# Altium schematic sheet STLink.SchDoc
size A; PageSetup: Record=PageOptions|CenterHorizontal=True|CenterVertical=True|PrintScale=1.07|XCorrection=1.00|YCorrection=1.00|PrintKind=1|BorderSize=5000000|LeftOffset=0|BottomOffset=0|Orientation=2|PaperLength=1000|PaperWidth=1000|Scale=100|PaperSource=257|PrintQuality=600|MediaType=1|DitherType=10|PrintScaleMode=1|PaperKind=Letter|PaperIndex=1
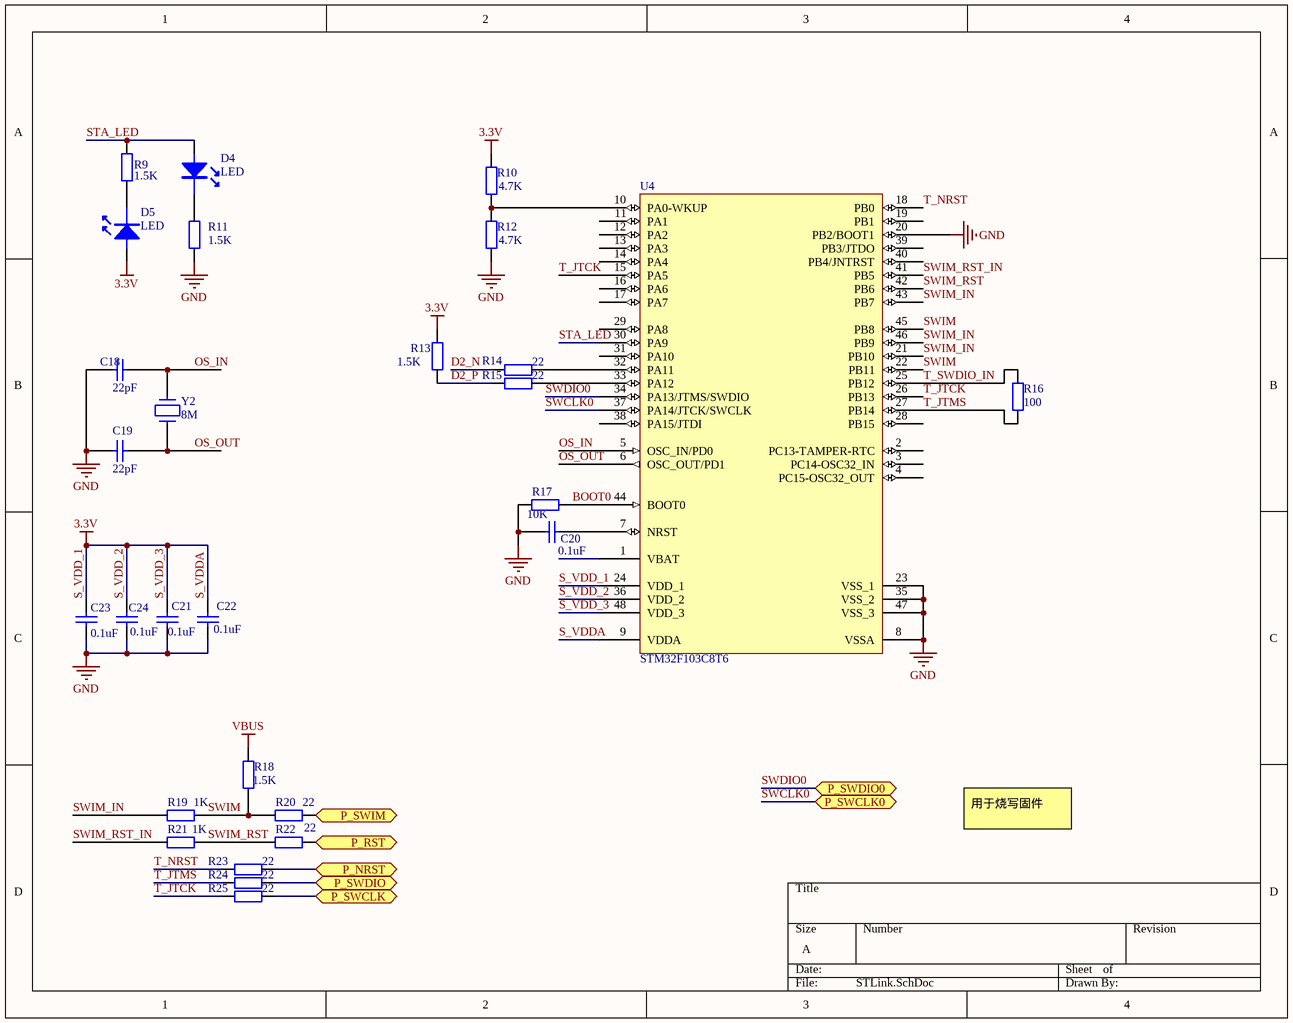
[diagram p0: STLink.SchDoc]

## Parts
C18  value 22pF  [C-0603]  (hidden comment: Cap)
C19  value 22pF  [C-0603]  (hidden comment: Cap)
C20  value 0.1uF  [C-0603]  (hidden comment: Cap)
C21  value 0.1uF  [C-0603]  (hidden comment: Cap)
C22  value 0.1uF  [C-0603]  (hidden comment: Cap)
C23  value 0.1uF  [C-0603]  (hidden comment: Cap)
C24  value 0.1uF  [C-0603]  (hidden comment: Cap)
D4  LED  [SMT_LED_0603]
D5  LED  [SMT_LED_0603]
R9  value 1.5K  [0603-1]  (hidden comment: Res2)
R10  value 4.7K  [0603-1]  (hidden comment: Res2)
R11  value 1.5K  [0603-1]  (hidden comment: Res2)
R12  value 4.7K  [0603-1]  (hidden comment: Res2)
R13  value 1.5K  [0603-1]  (hidden comment: Res2)
R14  value 22  [0603-1]  (hidden comment: Res2)
R15  value 22  [0603-1]  (hidden comment: Res2)
R16  value 100  [0603-1]  (hidden comment: Res2)
R17  value 10K  [0603-1]  (hidden comment: Res2)
R18  value 1.5K  [0603-1]  (hidden comment: Res2)
R19  value 1K  [0603-1]  (hidden comment: Res2)
R20  value 22  [0603-1]  (hidden comment: Res2)
R21  value 1K  [0603-1]  (hidden comment: Res2)
R22  value 22  [0603-1]  (hidden comment: Res2)
R23  value 22  [0603-1]  (hidden comment: Res2)
R24  value 22  [0603-1]  (hidden comment: Res2)
R25  value 22  [0603-1]  (hidden comment: Res2)
U4  STM32F103C8T6  [LQFP48_N]
Y2  8M  [XAL5032 2-Leads]

## Ports
P_NRST, P_RST, P_SWCLK, P_SWCLK0, P_SWDIO, P_SWDIO0, P_SWIM

## Nets
GND: C18.1 C19.1 C20.1 C21.1 C22.1 C23.1 C24.1 R11.1 R12.1 R17.1 U4.8(VSSA) U4.20(PB2/BOOT1) U4.23(VSS_1) U4.35(VSS_2) U4.47(VSS_3)
S_VDD_1: C21.2 C22.2 C23.2 C24.2 D5.1(A) R10.2 R13.2 U4.9(VDDA) U4.24(VDD_1) U4.36(VDD_2) U4.48(VDD_3)  [also labelled 3.3V, S_VDD_2, S_VDD_3, S_VDDA]
VBUS: R18.2
BOOT0: R17.2 U4.44(BOOT0)
D2_N: R14.1
D2_P: R13.1 R15.1
OS_IN: C18.2 U4.5(OSC_IN/PD0) Y2.2
OS_OUT: C19.2 U4.6(OSC_OUT/PD1) Y2.1
P_NRST: R23.2 ; port P_NRST
P_RST: R22.2 ; port P_RST
P_SWCLK: R25.2 ; port P_SWCLK
P_SWDIO: R24.2 ; port P_SWDIO
P_SWIM: R20.2 ; port P_SWIM
STA_LED: D4.1(A) R9.2 U4.30(PA9)
SWCLK0: U4.37(PA14/JTCK/SWCLK) ; port P_SWCLK0
SWDIO0: U4.34(PA13/JTMS/SWDIO) ; port P_SWDIO0
SWIM: R18.1 R19.2 R20.1 U4.22(PB11) U4.45(PB8)
SWIM_IN: R19.1 U4.21(PB10) U4.43(PB7) U4.46(PB9)
SWIM_RST: R21.2 R22.1 U4.42(PB6)
SWIM_RST_IN: R21.1 U4.41(PB5)
T_JTCK: R25.1 U4.15(PA5) U4.26(PB13)
T_JTMS: R16.1 R24.1 U4.27(PB14)
T_NRST: R23.1 U4.18(PB0)
T_SWDIO_IN: R16.2 U4.25(PB12)
NetC20_2: C20.2 U4.7(NRST)
NetD4_2: D4.2(K) R11.2
NetD5_2: D5.2(K) R9.1
NetR10_1: R10.1 R12.2 U4.10(PA0-WKUP)
NetR14_2: R14.2 U4.32(PA11)
NetR15_2: R15.2 U4.33(PA12)

Not connected (* = marked no-connect by the designer): U4 1(VBAT) 2(PC13-TAMPER-RTC) 3(PC14-OSC32_IN) 4(PC15-OSC32_OUT) 11(PA1) 12(PA2) 13(PA3) 14(PA4) 16(PA6) 17(PA7) 19(PB1) 28(PB15) 29(PA8) 31(PA10) 38(PA15/JTDI) 39(PB3/JTDO) 40(PB4/JNTRST)

## Notes on the sheet
- 用于烧写固件

## Library data of the parts
C21-C24 = Cap: Capacitor; Published: 8-Jun-2000; LatestRevisionDate: 17-Jul-2002; LatestRevisionNote: Re-released for DXP Platform.; PackageReference: RAD-0.3; Publisher: Altium Limited; PackageDescription: Radial Cap, Thru-Hole; 2 Leads; 0.3 in Pin Spacing
D4 D5 = LED: LED 发光二极管
R9-R25 = Res2: Resistor; Published: 8-Jun-2000; LatestRevisionDate: 17-Jul-2002; LatestRevisionNote: Re-released for DXP Platform.; PackageReference: AXIAL-0.4; Publisher: Altium Limited; PackageDescription: Axial Device, Thru-Hole; 2 Leads; 0.4 in Pin Spacing
U4 = STM32F103C8T6: STM32 ARM-based 32-bit MCU with 64 Kbytes Flash, 48-pin LQFP, Industrial Temperature; Published: 30-May-2008; DatasheetVersion: rev6, Mar-2008; PackageVersion: Mar-2008; PackageReference: LQFP48; Publisher: Altium Limited; PackageDescription: 48-Pin Low-Profile Quad Flat Pack, 7 x 7 mm Body, 0.5 mm Pitch (LQFP48); ComponentLink1Description: Manufacturer Link; ComponentLink1URL: www.st.com/stm32; ComponentLink2Description: Datasheet; ComponentLink2URL: http://www.st.com/stonline/products/literature/ds/13587.pdf
Y2 = XTAL